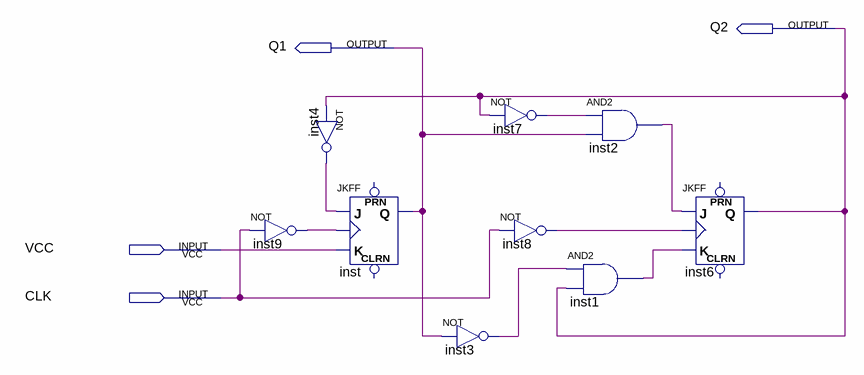
[diagram p0: schematic sheet]
// Quartus schematic Block1.bdf as structural Verilog: 9 symbols, 4 pins
module Block1 (
  input  VCC,
  input  CLK,
  output Q2,
  output Q1
);

  wire inst1_out, inst2_out, inst3_out, inst4_out, inst7_out, inst8_out, inst9_out;

  not inst9 (inst9_out, CLK);
  not inst4 (inst4_out, Q2);
  JKFF inst (.K(VCC), .J(inst4_out), .CLK(inst9_out), .Q(Q1));  // open: PRN, CLRN
  not inst3 (inst3_out, Q1);
  not inst7 (inst7_out, Q2);
  not inst8 (inst8_out, CLK);
  and inst2 (inst2_out, inst7_out, Q1);
  and inst1 (inst1_out, inst3_out, Q2);
  JKFF inst6 (.K(inst1_out), .J(inst2_out), .CLK(inst8_out), .Q(Q2));  // open: PRN, CLRN
endmodule
